# EAGLE design top_PCB_v1 (EAGLE 8.1.1)
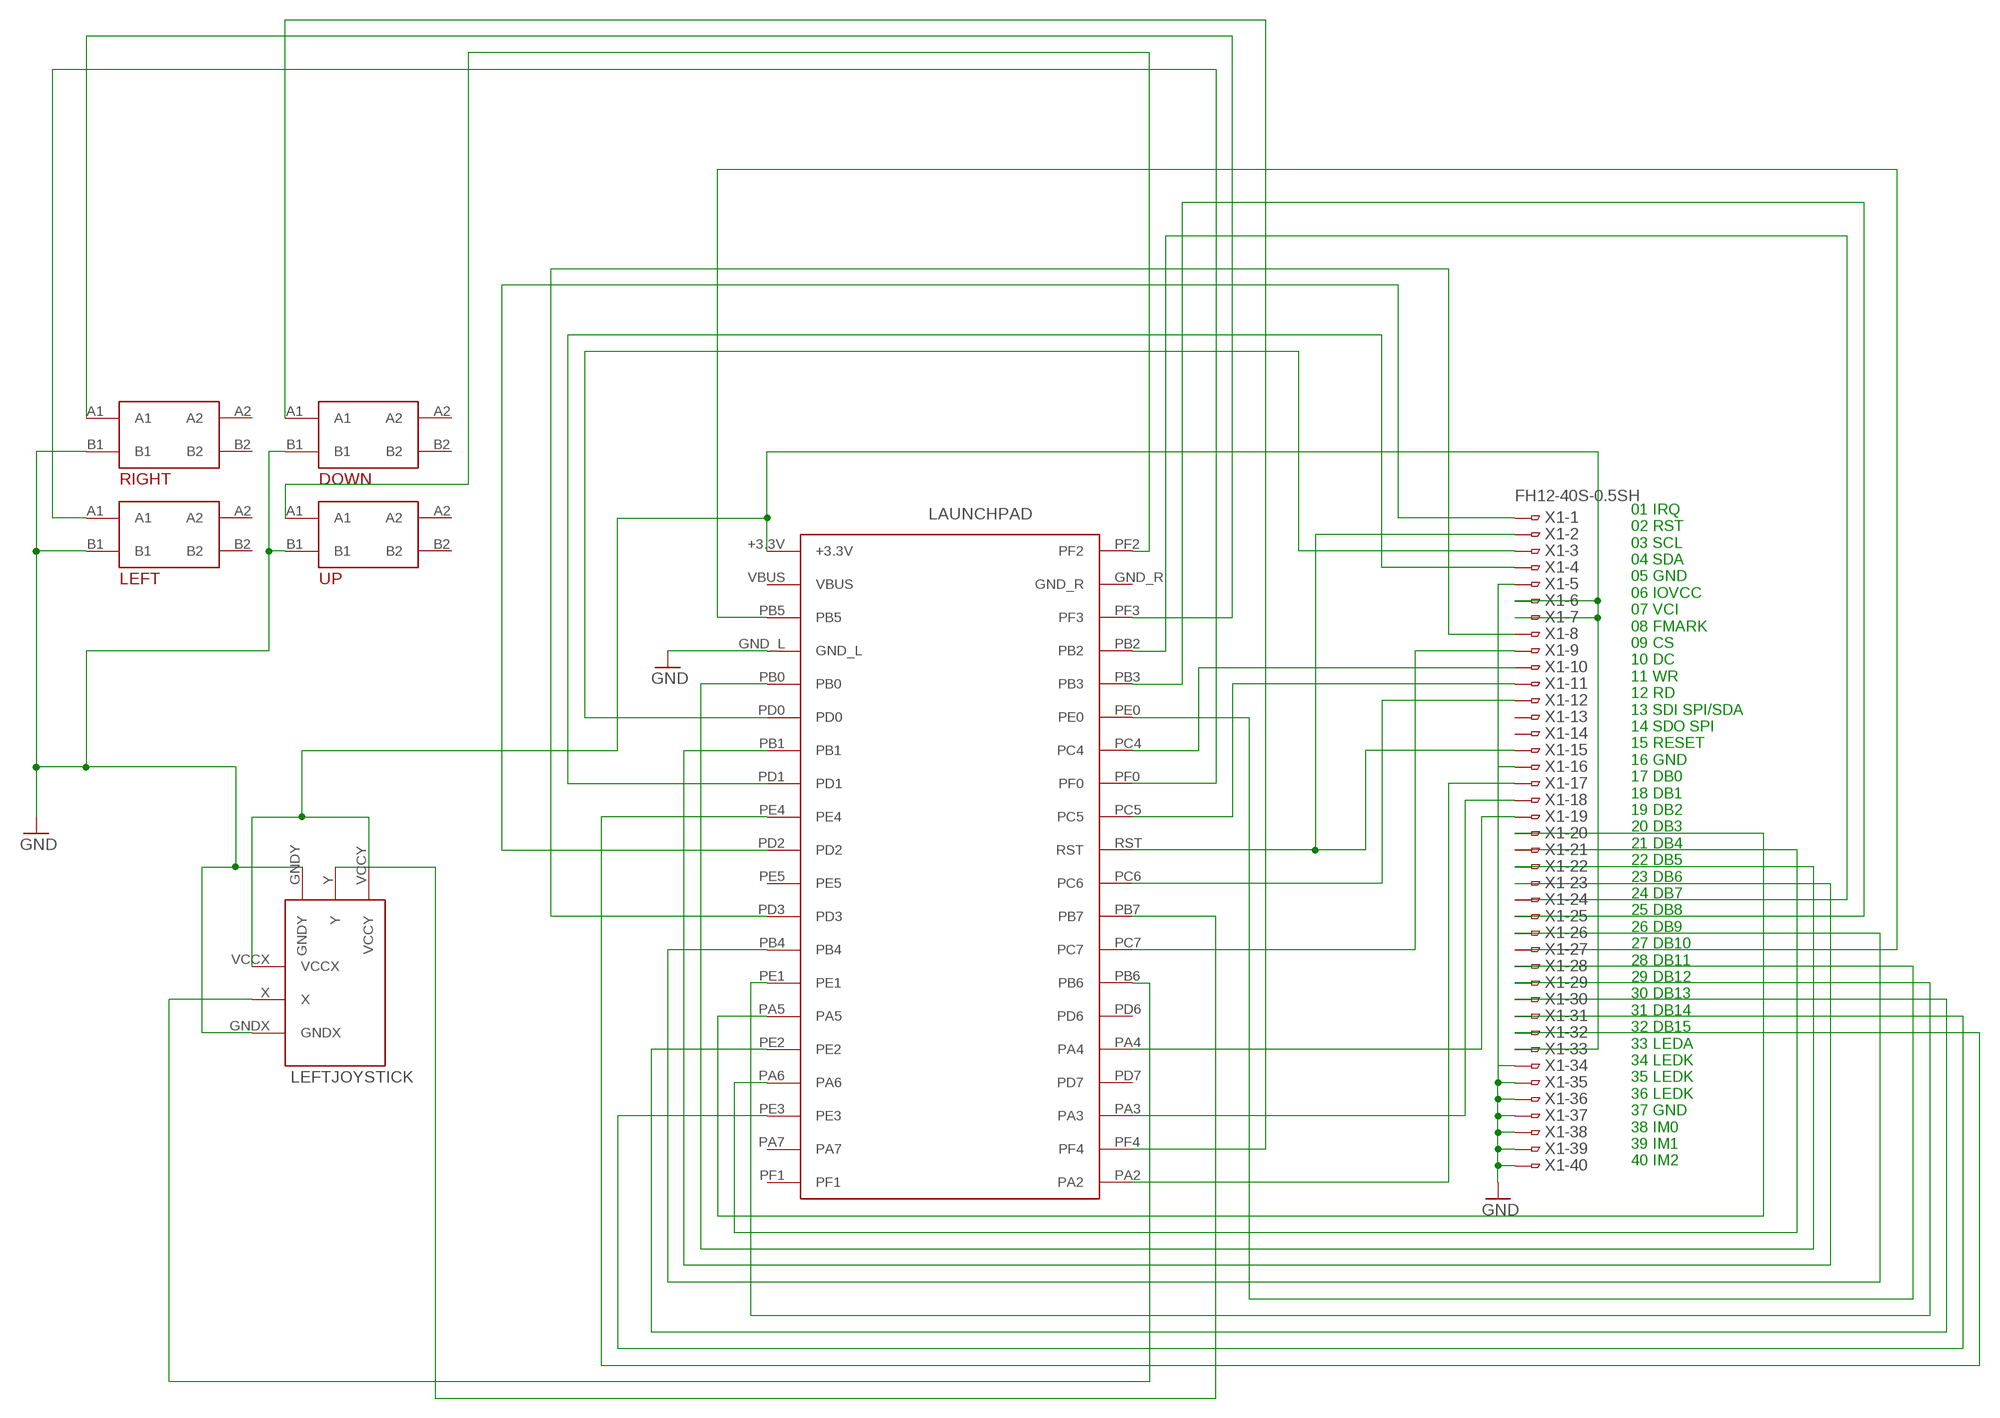
[diagram p0: schematic, sheet 1]

## Parts
DOWN  TACTILEBUTTONTHROUGHHOLE  [B3F-40XX-MOD]
LAUNCHPAD  TM4CTM4C  [1_05X2MM]
LEFT  TACTILEBUTTONTHROUGHHOLE  [B3F-40XX-MOD]
LEFTJOYSTICK  JOYSTICKADAFRUIT  [JOYSTICK]
RIGHT  TACTILEBUTTONTHROUGHHOLE  [B3F-40XX-MOD]
UP  TACTILEBUTTONTHROUGHHOLE  [B3F-40XX-MOD]
X1  FH12-40S-0.5SH  [FH12-40S-0.5SH]

## Nets
GND: DOWN.B1 LAUNCHPAD.GND_L LEFT.B1 LEFTJOYSTICK.GNDX LEFTJOYSTICK.GNDY RIGHT.B1 UP.B1 X1.5 X1.16 X1.34 X1.35 X1.36 X1.37 X1.38 X1.39 X1.40
N$1: LAUNCHPAD.PD3 X1.8
N$2: LAUNCHPAD.RST X1.2 X1.15
N$3: LAUNCHPAD.PC4 X1.10
N$5: LAUNCHPAD.PC5 X1.11
N$6: LAUNCHPAD.PC6 X1.12
N$7: LAUNCHPAD.PC7 X1.9
N$8: LAUNCHPAD.PA2 X1.17
N$9: LAUNCHPAD.PF2 UP.A1
N$10: LAUNCHPAD.PD0 X1.3
N$11: LAUNCHPAD.PD1 X1.4
N$12: LAUNCHPAD.PD2 X1.1
N$13: LAUNCHPAD.PA3 X1.18
N$14: LAUNCHPAD.PA4 X1.19
N$15: LAUNCHPAD.PA5 X1.20
N$16: LAUNCHPAD.PA6 X1.21
N$17: LAUNCHPAD.PB0 X1.22
N$18: LAUNCHPAD.PB1 X1.23
N$19: LAUNCHPAD.PB2 X1.24
N$20: LAUNCHPAD.PB3 X1.25
N$21: LAUNCHPAD.PB4 X1.26
N$22: LAUNCHPAD.PB5 X1.27
N$23: LAUNCHPAD.PE0 X1.28
N$24: LAUNCHPAD.PE1 X1.29
N$25: LAUNCHPAD.PE2 X1.30
N$26: LAUNCHPAD.PE3 X1.31
N$27: LAUNCHPAD.PE4 X1.32
N$28: LAUNCHPAD.PB6 LEFTJOYSTICK.X
N$29: LAUNCHPAD.PF0 LEFT.A1
N$30: LAUNCHPAD.PF3 RIGHT.A1
N$31: LAUNCHPAD.+3.3V LEFTJOYSTICK.VCCX LEFTJOYSTICK.VCCY X1.6 X1.7 X1.33
N$32: DOWN.A1 LAUNCHPAD.PF4
N$34: LAUNCHPAD.PB7 LEFTJOYSTICK.Y
Unconnected: DOWN.A2 DOWN.B2 LAUNCHPAD.PA7 LAUNCHPAD.PD6 LAUNCHPAD.PD7 LAUNCHPAD.PE5 LAUNCHPAD.PF1 LEFT.A2 LEFT.B2 RIGHT.A2 RIGHT.B2 UP.A2 UP.B2 X1.13 X1.14

## Notes on the sheet
- 01 IRQ
  02 RST
  03 SCL
  04 SDA
  05 GND
  06 IOVCC
  07 VCI
  08 FMARK
  09 CS
  10 DC
  11 WR
  12 RD
  13 SDI SPI/SDA
  14 SDO SPI
  15 RESET
  16 GND
  17 DB0
  18 DB1
  19 DB2
  20 DB3
  21 DB4
  22 DB5
  23 DB6
  24 DB7
  25 DB8
  26 DB9
  27 DB10
  28 DB11
  29 DB12
  30 DB13
  31 DB14
  32 DB15
  33 LEDA
  34 LEDK
  35 LEDK
  36 LEDK
  37 GND
  38 IM0
  39 IM1
  40 IM2

## Power pins joined to a net without a drawn wire
GND_R: LAUNCHPAD.GND_R
VBUS: LAUNCHPAD.VBUS

## Library data of the parts
DOWN LEFT RIGHT UP = AdafruitButton:TACTILEBUTTON: Basic library for Adafruit Round Colorful Tactile Button
LAUNCHPAD = TM4C:TM4C: Tiva TM4C Lauchpad. Untested.
LEFTJOYSTICK = AdafruitJoystick:JOYSTICK: Basic version of the Adafruit 2-Axis Analog Thumbstick (PID: 2765). With credits to this (https://github.com/adafruit/Adafruit-Mini-Analog-Thumbstick-Breakout-PCB)
X1 = con-hirose:FH12-40S-0.5S: 0.5mm Pitch Connectors For FPC/FFC Source: Data sheet <http://www.hirose.co.jp/cataloge_hp/e58605370.pdf>; MPN: FH12-40S-0.5SH(55); OC_FARNELL: 1324556; OC_NEWARK: 34M6178

## Board
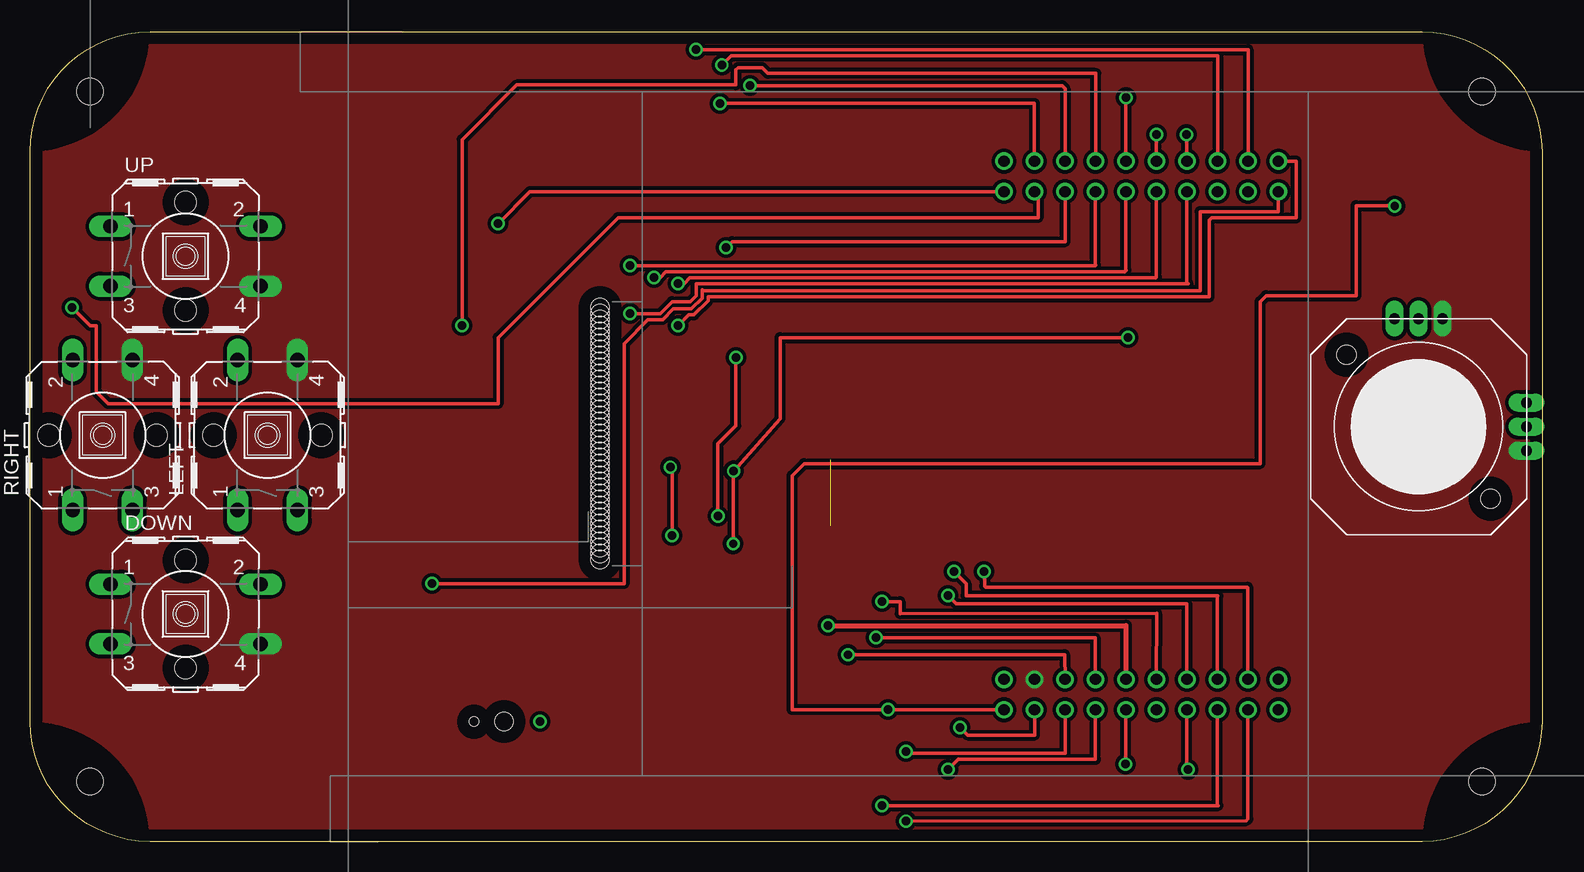
[diagram p1: board, top side]
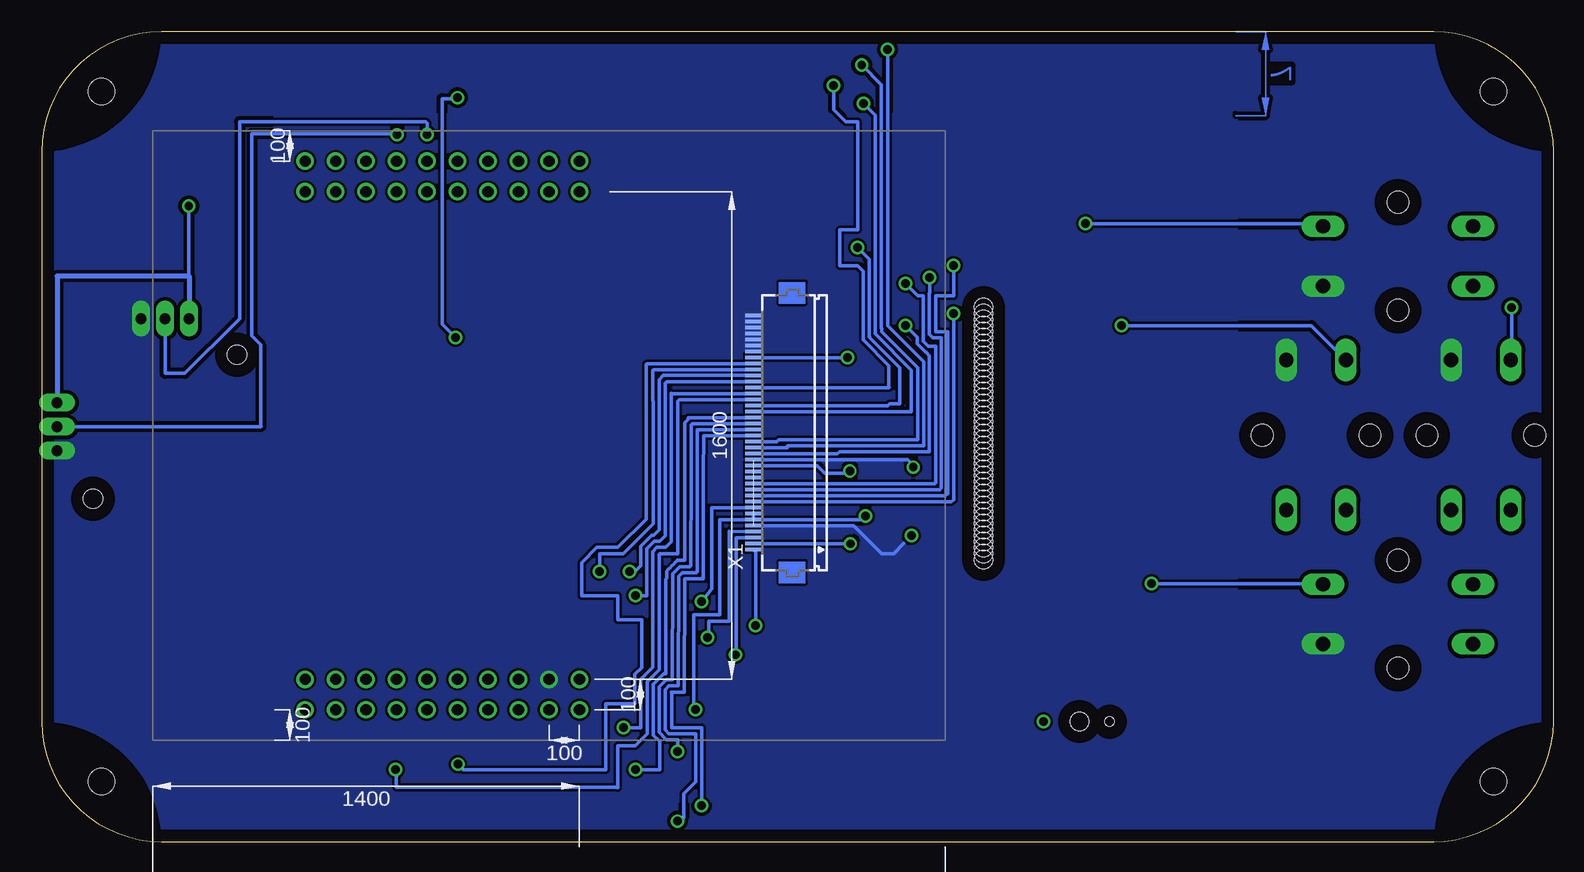
[diagram p2: board, bottom side, seen from below]

Size 126 x 67.5 mm. Coordinates in mm from the lower left corner, seen from the top.
Outline: 0,57.5 arc-90 10,67.5 116,67.5 arc-90 126,57.5 126,10 arc-90 116,0 10,0 arc-90 0,10 0,57.5
Copper layers (1*16): Top 0.035mm / dielectric 1.5mm / Bottom 0.035mm
Design rules "default": minimum track width 10mil, minimum drill 24mil, track to track 8mil, track to pad 8mil, pad to pad 8mil, via to via 8mil, smd to smd 8mil, copper to edge 40mil, drill to drill 8mil, minimum pad ring 10mil, minimum via ring 8mil, stop-mask expansion 4mil, vias tented up to drill 0mil, thermal gap 10mil
Holes 1.5 mm at 47.5,44.5 47.5,44 47.5,43.5 47.5,43 47.5,42.5 47.5,42 47.5,41.5 47.5,41 47.5,40.5 47.5,40 47.5,39.5 47.5,39 47.5,38.5 47.5,38 47.5,37.5 47.5,37 47.5,36.5 47.5,36 47.5,35.5 47.5,35 47.5,34.5 47.5,34 47.5,33.5 47.5,33 47.5,32.5 47.5,32 47.5,31.5 47.5,31 47.5,30.5 47.5,30 47.5,29.5 47.5,29 47.5,28.5 47.5,28 47.5,27.5 47.5,27 47.5,26.5 47.5,26 47.5,25.5 47.5,25 47.5,24.5 47.5,24 47.5,23.5 39.5,10
Holes 2.2 mm at 5,5 5,62.5 121,62.5 121,5
Holes 0.8 mm at 37,10

### Footprints (pad centres in the part's own frame; a part is rotated, then mirrored left to right if it is on the bottom)
B3F-40XX-MOD = drill 1.194 long: A1 6.218,2.559; A2 -6.278,2.559; B1 6.218,-2.419; B2 -6.278,-2.419 | hole 1.803: -0.03,-4.426; -0.03,4.566
1_05X2MM = drill 0.94: +3.3V -7.62,8.89; GND_L -10.16,6.35; GND_R -53.34,8.89; PA2 -53.34,-13.97; PA3 -53.34,-11.43; PA4 -53.34,-8.89; PA5 -7.62,-8.89; PA6 -7.62,-11.43; PA7 -7.62,-13.97; PB0 -7.62,3.81; PB1 -7.62,1.27; PB2 -53.34,6.35; PB3 -50.8,3.81; PB4 -7.62,-6.35; PB5 -7.62,6.35; PB6 -53.34,-6.35; PB7 -53.34,-3.81; PC4 -50.8,1.27; PC5 -50.8,-1.27; PC6 -50.8,-3.81; PC7 -50.8,-6.35; PD0 -10.16,3.81; PD1 -10.16,1.27; PD2 -10.16,-1.27; PD3 -10.16,-3.81; PD6 -50.8,-8.89; PD7 -50.8,-11.43; PE0 -53.34,3.81; PE1 -10.16,-6.35; PE2 -10.16,-8.89; PE3 -10.16,-11.43; PE4 -7.62,-1.27; PE5 -7.62,-3.81; PF0 -53.34,1.27; PF1 -10.16,-13.97; PF2 -50.8,8.89; PF3 -50.8,6.35; PF4 -50.8,-13.97; RST -53.34,-1.27; VBUS -10.16,8.89
JOYSTICK = drill 0.9 pad 1.5 long: GNDX 8.62,-2.33; GNDY 1.62,8.67; VCCX 8.62,1.67; VCCY -2.38,8.67; X 8.62,-0.33; Y -0.38,8.67 | hole 1.6: -6.38,5.67; 5.62,-6.33
FH12-40S-0.5SH = smd 0.3 x 1.3: 1 -9.75,3.25; 2 -9.25,3.25; 3 -8.75,3.25; 4 -8.25,3.25; 5 -7.75,3.25; 6 -7.25,3.25; 7 -6.75,3.25; 8 -6.25,3.25; 9 -5.75,3.25; 10 -5.25,3.25; 11 -4.75,3.25; 12 -4.25,3.25; 13 -3.75,3.25; 14 -3.25,3.25; 15 -2.75,3.25; 16 -2.25,3.25; 17 -1.75,3.25; 18 -1.25,3.25; 19 -0.75,3.25; 20 -0.25,3.25; 21 0.25,3.25; 22 0.75,3.25; 23 1.25,3.25; 24 1.75,3.25; 25 2.25,3.25; 26 2.75,3.25; 27 3.25,3.25; 28 3.75,3.25; 29 4.25,3.25; 30 4.75,3.25; 31 5.25,3.25; 32 5.75,3.25; 33 6.25,3.25; 34 6.75,3.25; 35 7.25,3.25; 36 7.75,3.25; 37 8.25,3.25; 38 8.75,3.25; 39 9.25,3.25; 40 9.75,3.25

### Placement (x,y rotation side)
DOWN  12.99,18.89 0 top
LAUNCHPAD  90.06,3.36 270 bottom
LEFT  19.86,33.9 90 top
LEFTJOYSTICK  116.09,34.9 0 top
RIGHT  6.12,33.9 90 top
UP  12.99,48.71 0 top
X1  63.45,34.08 90 bottom

### Tracks (layer width: path | path; a pad name or v marks a point on that pad's centre or on a via)
GND  (1 unrouted)
  Bottom 0.305: X1.5 58.33,26.33 56,24 55,24 54.14,24.86 | X1.16 53.83,31.83 53.5,31.5
  pour Bottom (isolate 0.305, no thermals): 10,67.5 arc-90 0,57.5 0,10 arc-90 10,0 116,0 arc-90 126,10 126,57.5 arc-90 116,67.5
  pour Top (isolate 0.305, no thermals): 10,67.5 arc-90 0,57.5 0,10 arc-90 10,0 116,0 arc-90 126,10 126,57.5 arc-90 116,67.5
N$1  (via drill 0.7)
  Top 0.305: v71,20 72.5,20 72.5,19 93.89,19.03 LAUNCHPAD.PD3
  Bottom 0.305: X1.8 70.13,27.8 70.15,21.05 v71,20
N$2  (via drill 0.7)
  Top 0.305: v58.6,24.82 58.61,31.32 v58.64,30.88 62.5,35.24 62.5,42 v91.5,42 | v91.34,61.99 v91.33,61.98 LAUNCHPAD.RST
  Bottom 0.305: X1.2 58.76,24.83 v58.6,24.82 | v91.5,42 92.61,43.11 92.61,61.91 91.42,61.91 v91.34,61.99 | X1.15 61.37,31.33 60.75,30.71 58.81,30.71 v58.64,30.88
N$3  (via drill 0.7)
  Top 0.305: v50,48 88.78,48 88.8,48.02 88.79,48.03 LAUNCHPAD.PC4
  Bottom 0.305: X1.10 50.67,28.83 50.5,29 50.5,42.5 51.5,42.5 51.5,45.5 50,45.5 v50,48
N$4  (via drill 0.7)
  other vias: 42.5,10
N$5  (via drill 0.7)
  Top 0.305: v52,47 52.5,47 52.99,47.49 91.22,47.49 91.34,47.61 91.33,47.62 LAUNCHPAD.PC5
  Bottom 0.305: X1.11 51.15,29.33 51.01,29.47 51.01,41.99 51.71,41.99 52.01,42.29 52.01,45.71 52,45.72 v52,47
N$6  (via drill 0.7)
  Top 0.305: v54,46.5 54.5,46.5 54.98,46.98 93.82,46.98 93.87,47.03 LAUNCHPAD.PC6
  Bottom 0.305: X1.12 51.58,29.83 | 51.58,29.83 51.55,29.86 | 51.58,29.83 51.5,29.91 51.5,41.27 52.09,41.27 52.52,41.7 52.52,45.5 53,45.5 v54,46.5
N$7  (via drill 0.7)
  Top 0.305: v50,44 52.5,44 53.5,45 55,45 55.5,45.5 55.5,46.48 96.48,46.48 96.5,46.5 96.41,46.59 LAUNCHPAD.PC7
  Bottom 0.305: X1.9 50.17,28.33 50,28.5 v50,44
N$8  (via drill 0.7)
  Top 0.305: v54,43 54.88,43.88 55.32,43.88 56.52,45.08 56.52,45.41 56.54,45.39 98.27,45.39 98.27,51.77 98.49,51.99 98.5,51.98 105.51,51.98 105.51,56.68 105.49,56.7 LAUNCHPAD.PA2
  Bottom 0.305: X1.17 59.67,32.33 59.5,32.5 52.01,32.5 52.01,40.5 52.27,40.76 52.3,40.76 53.02,41.49 | 53.02,41.5 53.02,41.49 | 53.02,41.49 53.02,42.02 v54,43
N$9  (via drill 0.7)
  Top 0.305: LAUNCHPAD.PF2 41.66,54.16 v39,51.5
  Bottom 0.305: v39,51.5 19.44,51.5 UP.A1
N$10  (via drill 0.7)
  Top 0.305: v68.17,15.57 86.21,15.57 LAUNCHPAD.PD0
  Bottom 0.305: X1.3 68.11,25.31 68.12,15.55 v68.17,15.57
N$11  (via drill 0.7)
  Top 0.305: v70.5,17 88.77,16.97 LAUNCHPAD.PD1
  Bottom 0.305: X1.4 68.67,25.84 68.71,18.38 70.39,18.38 70.39,17.49 v70.5,17
N$12  (via drill 0.7)
  Top 0.406: v66.5,18 91.33,18 91.34,17.99 91.33,17.98 LAUNCHPAD.PD2
  Bottom 0.305: X1.1 66.5,24.13 v66.5,18
N$13  (via drill 0.7)
  Top 0.305: v55.5,66 101.5,66 LAUNCHPAD.PA3
  Bottom 0.305: X1.18 64,32.82 | 64,32.82 63.87,32.82 | 64,32.82 63.82,33 52.5,33 52.5,40 55.5,43 v55.5,66
N$14  (via drill 0.7)
  Top 0.305: v57.65,64.72 58.42,65.49 98.96,65.49 LAUNCHPAD.PA4
  Bottom 0.305: X1.19 64.75,33.32 64.57,33.5 53,33.5 53,39.5 56,42.5 56,42.78 56.01,42.79 56.01,63.08 v57.65,64.72
N$15  (via drill 0.7)
  Top 0.305: v71,3 99,3 98.95,3.05 LAUNCHPAD.PA5
  Bottom 0.305: v71,3 71,9.5 73.5,9.5 73.5,12.45 73.51,12.46 72.42,12.46 72.39,21.9 70.87,21.91 70.84,21.94 70.84,24.26 70.85,24.27 70.85,27.82 70.84,30.26 70.84,30.46 70.84,30.68 | 70.84,30.68 | 70.84,30.68 70.83,33.82 X1.20
N$16  (via drill 0.7)
  Top 0.305: v73,1.7 101.35,1.75 101.49,1.89 LAUNCHPAD.PA6
  Bottom 0.305: X1.21 | v73,1.7 72.5,2 72.5,4 71.5,5 71.5,9 73.72,9 74.02,9.3 74.02,12.67 73.72,12.97 72.96,12.97 72.93,13 72.9,21.9 72.9,22.11 72.75,22.26 72.6,22.41 72.39,22.41 71.43,22.41 71.38,22.47 71.35,30.47 71.34,34.32 X1.21
N$17  (via drill 0.7)
  Top 0.305: v73,7.5 73.15,7.35 86.24,7.35 86.25,7.36 LAUNCHPAD.PB0
  Bottom 0.305: 72.81,22.92 72.57,22.92 72.39,22.92 71.97,22.92 71.88,23 71.86,30.48 71.86,34.75 71.79,34.82 71.56,34.82 71.55,34.83 X1.22 | 72.81,22.92 | 72.81,22.92 | 72.81,22.92 72.81,22.91 72.82,22.91 | 72.82,22.91 | 72.82,22.91 72.95,22.78 73.11,22.62 | 73.11,22.62 | 73.11,22.62 | 73.11,22.62 73.11,22.61 73.14,22.58 73.41,22.32 | 73.41,22.32 | 73.41,22.32 | 73.41,22.32 73.41,22.31 | 73.41,22.31 | 73.41,22.31 | 73.41,22.31 73.41,22.08 73.41,21.9 | 73.41,21.9 | 73.41,21.9 73.43,13.58 73.43,13.48 73.93,13.48 74.53,12.88 74.53,9.09 73.93,8.49 73,8.49 v73,7.5
N$18  (via drill 0.7)
  Top 0.305: v76.5,6 77.34,6.84 86.45,6.84 86.46,6.85 88.78,6.85 88.79,6.86 LAUNCHPAD.PB1
  Bottom 0.305: X1.23 72,35.33 | 72,35.33 72.11,35.33 | 72,35.33 72.41,34.92 72.41,23.45 72.44,23.42 72.56,23.43 72.6,23.43 | 72.6,23.43 | 72.6,23.43 72.8,23.43 73.02,23.43 | 73.02,23.43 | 73.03,23.42 | 73.03,23.42 73.18,23.27 73.33,23.12 73.47,22.97 73.48,22.97 73.61,22.83 73.76,22.68 73.91,22.54 | 73.91,22.54 | 73.92,22.52 | 73.92,22.52 73.92,22.31 73.92,22.1 73.92,21.94 74,21.86 74,13.98 74.14,13.98 75.03,13.09 75.03,8.88 74.5,8.35 74.5,6 v76.5,6 | 73.02,23.43 73.03,23.43 73.03,23.42 | 73.92,22.52 73.91,22.53 73.91,22.54 | 73.91,22.54 | 73.91,22.54
N$19  (via drill 0.7)
  Top 0.305: v57.5,61.5 57.52,61.52 83.69,61.52 83.69,56.72 LAUNCHPAD.PB2
  Bottom 0.305: v57.5,61.5 56.52,60.52 56.52,42.3 53.51,39.29 53.51,35.83 X1.24
N$20  (via drill 0.7)
  Top 0.305: v58,49.5 58.5,50 86.27,50 86.27,54.14 LAUNCHPAD.PB3
  Bottom 0.305: v58,49.5 57.02,48.52 57.02,42.09 57,42.06 57,42 54.5,39.5 54.5,36.5 55.33,36.5 55.5,36.33 X1.25
N$21  (via drill 0.7)
  Top 0.305: v96.5,6 96.41,6.09 LAUNCHPAD.PB4
  Bottom 0.305: X1.26 72.87,36.82 73,36.69 73,24 74.5,24 74.54,23.96 74.54,14.3 75.54,13.3 75.54,9 76.54,8 78,8 78,4.5 78.02,4.52 96.43,4.52 96.43,5.87 96.5,5.94 v96.5,6
N$22  (via drill 0.7)
  Top 0.305: v77.5,9.5 78.13,8.87 83.71,8.87 LAUNCHPAD.PB5
  Bottom 0.305: 66.72,37.35 X1.27 73.51,37.34 | 73.51,37.34 73.52,37.35 | 73.51,37.34 73.51,25 74,24.51 74.71,24.51 75.05,24.17 75.05,14.51 76.05,13.51 76.05,9.5 v77.5,9.5
N$23  (via drill 0.7)
  Top 0.305: v60,63 86,63 86.25,62.75 LAUNCHPAD.PE0
  Bottom 0.305: 66.68,37.85 X1.28 55.38,37.83 | 57.53,41.81 57.53,42 | 57.53,42 57.53,47.53 58,48 59.5,48 59.5,51 58,51 58,60 59,60 60,61 v60,63 | 55.38,37.83 55.37,37.84 | 55.38,37.83 55.38,39.66 57.53,41.81 | 57.53,42 57.53,41.81
N$24  (via drill 0.7)
  Top 0.305: v76.5,20.5 77.2,19.8 96.38,19.8 96.41,19.77 LAUNCHPAD.PE1
  Bottom 0.305: X1.29 73.89,38.32 74.03,38.18 74.03,37.14 74.02,37.13 74.02,25.5 74.5,25.02 74.92,25.02 75.56,24.38 75.56,20.5 v76.5,20.5
N$25  (via drill 0.7)
  Top 0.305: v77,22.5 78,21.5 78,20.5 78.03,20.47 98.98,20.47 98.95,20.44 LAUNCHPAD.PE2
  Bottom 0.305: X1.30 74.18,38.84 74.54,38.48 74.54,36.93 74.52,36.92 74.52,26 75,25.52 75.13,25.52 76.06,24.59 76.06,23 76.56,22.5 v77,22.5
N$26  (via drill 0.7)
  Top 0.305: v79.5,22.5 79.56,22.44 79.56,21.28 79.64,21.2 101.44,21.2 101.49,21.15 LAUNCHPAD.PE3
  Bottom 0.305: 66.72,39.35 X1.31 74.98,39.33 75.04,39.27 75.04,36.72 75.03,36.71 75.03,26.5 77.53,24 79.5,24 v79.5,22.5
N$27  (via drill 0.7)
  Top 0.305: v91.3,6.45 91.33,6.48 LAUNCHPAD.PE4
  Bottom 0.305: v91.3,6.45 90.85,6 79,6 79,11.5 76.56,11.5 76.56,13.94 76,14.5 76,18.5 78,18.5 78,20.5 81,20.5 81,23.22 79.71,24.51 77.97,24.51 75.61,26.87 75.61,39.76 75.54,39.83 X1.32
N$28  (via drill 0.7)
  Top 0.305: LAUNCHPAD.PB6 96.41,58.87 v96.37,58.91
  Bottom 0.305: LEFTJOYSTICK.X 107.74,34.57 107.71,34.6 107.74,34.63 107.74,41.38 108.5,42.14 108.5,59 96.46,59 v96.37,58.91
N$29  (via drill 0.7)
  Top 0.305: LAUNCHPAD.PF0 88.83,56.74 88.83,64.01 61.49,64.01 61,64.5 59,64.5 58.81,64.31 58.81,63.05 40.55,63.05 36,58.5 v36,43
  Bottom 0.305: v36,43 20.18,43 LEFT.A1
N$30  (via drill 0.7)
  Top 0.305: LAUNCHPAD.PF3 84,53.87 84,52 49,52 39,42 39,36.5 6.5,36.5 5.5,37.5 5.5,43 5,43 v3.5,44.5
  Bottom 0.305: v3.5,44.5 3.5,39.5 3.56,39.56 RIGHT.A1
N$31  (via drill 0.7)
  Top 0.305: LAUNCHPAD.+3.3V v71.5,11 63.5,11 63.5,30.5 64.5,31.5 102.5,31.5 102.5,45 103,45.5 110.5,45.5 110.5,53 110.53,52.97 v113.73,52.97 | v58.83,40.33 58.83,34.66 57.33,33.16 v57.33,27.12
  Bottom 0.305: X1.7 X1.6 | X1.6 69.14,26.82 69.47,26.82 69.47,18.89 71.64,18.91 71.63,10.97 v71.5,11 | v113.73,52.97 113.73,47.14 113.71,47.12 | X1.33 v58.83,40.33 | X1.6 57.62,26.83 v57.33,27.12
  Bottom 0.406: LEFTJOYSTICK.VCCY 113.71,47.12 124.71,47.12 LEFTJOYSTICK.VCCX
N$32  (via drill 0.7)
  Top 0.305: LAUNCHPAD.PF4 104,54.13 104,52.5 97.5,52.5 97.5,45.92 56.08,45.92 56.03,45.97 56.01,45.94 56.01,45.29 55.11,44.39 53.61,44.39 52.71,43.49 51.49,43.49 49.5,41.5 49.5,21.5 v33.5,21.5
  Bottom 0.305: v33.5,21.5 19.26,21.5 DOWN.A1
N$33
  pour Bottom: 26.5,60.5 106.5,60.5 106.5,3.5 26.5,3.5
N$34  (via drill 0.7)
  Top 0.305: LAUNCHPAD.PB7 v93.87,58.92
  Bottom 0.305: LEFTJOYSTICK.Y 115.7,39.01 114.05,39.01 109.78,43.28 | 109.78,43.28 109.5,43.56 | v93.87,58.92 93.87,59.87 94,60 109.5,60 109.5,43.56 | 109.5,43.56 109.78,43.28
N$35  (via drill 0.7)
  Top 0.305: v53.36,31.2 53.5,31.06 v53.5,25.5
(copper drawn outside any net)
  shapes: Bottom area x1